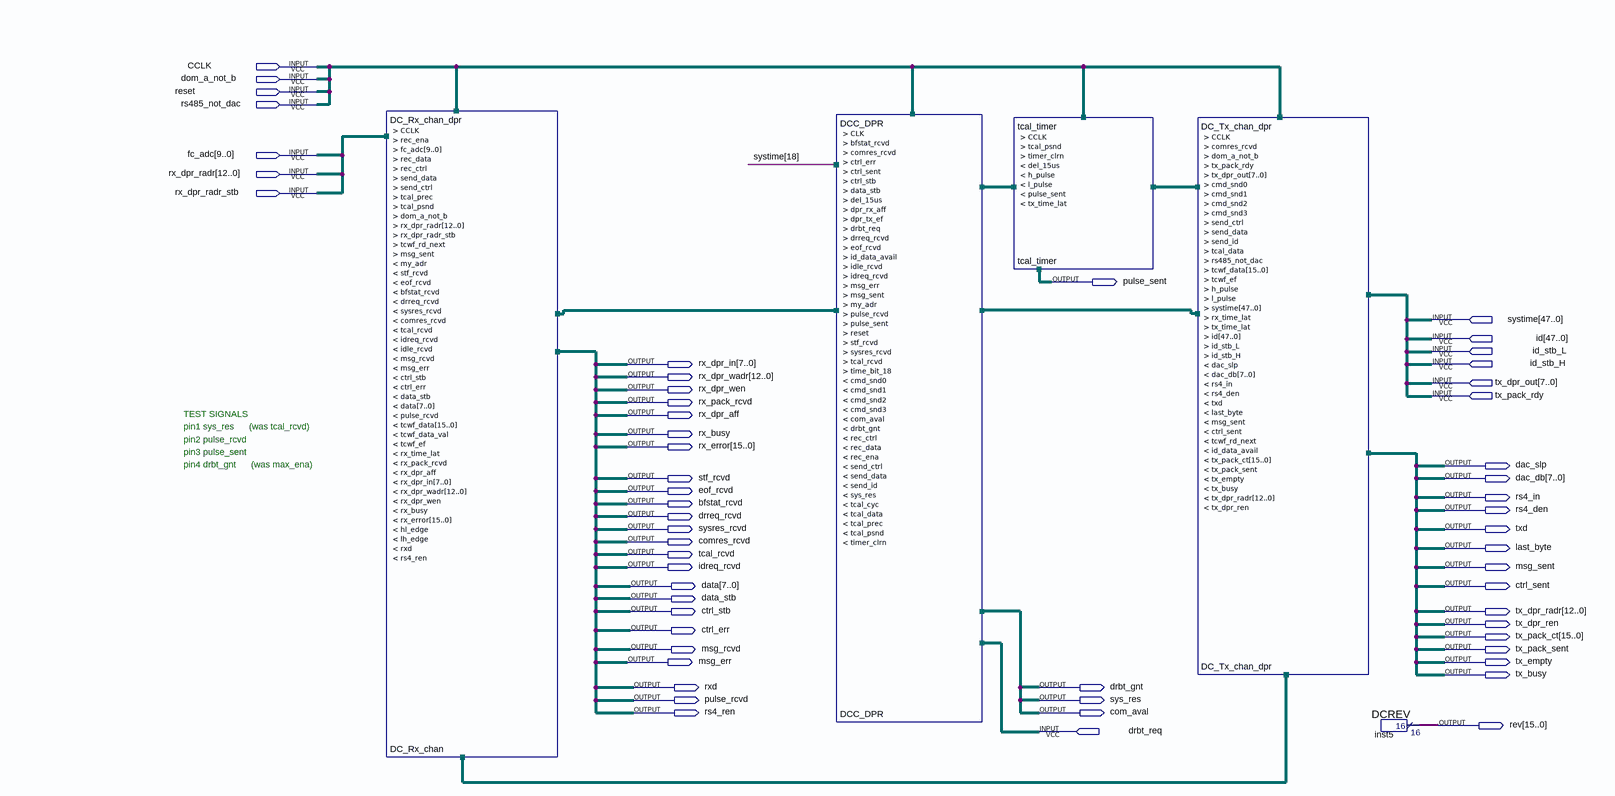
[diagram p0: schematic sheet]
// Quartus schematic dcom_dpr_bak.bdf as structural Verilog: 5 symbols, 57 pins
module dcom_dpr_bak (
  input  CCLK,
  input  dom_a_not_b,
  input  reset,
  input  rs485_not_dac,
  input  [9:0] fc_adc,
  input  [12:0] rx_dpr_radr,
  input  rx_dpr_radr_stb,
  input  [47:0] systime,
  input  [47:0] id,
  input  id_stb_L,
  input  id_stb_H,
  input  [7:0] tx_dpr_out,
  input  tx_pack_rdy,
  input  drbt_req,
  output pulse_sent,
  output [7:0] rx_dpr_in,
  output [12:0] rx_dpr_wadr,
  output rx_dpr_wen,
  output rx_pack_rcvd,
  output rx_dpr_aff,
  output rx_busy,
  output [15:0] rx_error,
  output dac_slp,
  output stf_rcvd,
  output [7:0] dac_db,
  output eof_rcvd,
  output rs4_in,
  output bfstat_rcvd,
  output rs4_den,
  output drreq_rcvd,
  output sysres_rcvd,
  output txd,
  output comres_rcvd,
  output last_byte,
  output tcal_rcvd,
  output idreq_rcvd,
  output msg_sent,
  output [7:0] data,
  output ctrl_sent,
  output data_stb,
  output ctrl_stb,
  output [12:0] tx_dpr_radr,
  output tx_dpr_ren,
  output ctrl_err,
  output [15:0] tx_pack_ct,
  output msg_rcvd,
  output tx_pack_sent,
  output msg_err,
  output tx_empty,
  output tx_busy,
  output rxd,
  output drbt_gnt,
  output pulse_rcvd,
  output sys_res,
  output rs4_ren,
  output com_aval,
  output [15:0] rev
);

  wire cmd_snd0, cmd_snd1, cmd_snd2, cmd_snd3, del_15us, h_pulse, id_data_avail, idle_rcvd, l_pulse, my_adr,
       rec_ctrl, rec_data, rec_ena, rx_time_lat, send_ctrl, send_data, send_id, tcal_data, tcal_prec,
       tcal_psnd, tcwf_ef, tcwf_rd_next, timer_clrn, tx_time_lat;
  wire [15:0] tcwf_data;

  DC_Rx_chan_dpr DC_Rx_chan (
    .CCLK(CCLK), .rec_ena(rec_ena), .fc_adc(fc_adc), .rec_data(rec_data), .rec_ctrl(rec_ctrl),
    .send_data(send_data), .send_ctrl(send_ctrl), .tcal_prec(tcal_prec), .tcal_psnd(tcal_psnd),
    .dom_a_not_b(dom_a_not_b), .rx_dpr_radr(rx_dpr_radr), .rx_dpr_radr_stb(rx_dpr_radr_stb),
    .tcwf_rd_next(tcwf_rd_next), .msg_sent(msg_sent), .my_adr(my_adr), .stf_rcvd(stf_rcvd),
    .eof_rcvd(eof_rcvd), .bfstat_rcvd(bfstat_rcvd), .drreq_rcvd(drreq_rcvd), .sysres_rcvd(sysres_rcvd),
    .comres_rcvd(comres_rcvd), .tcal_rcvd(tcal_rcvd), .idreq_rcvd(idreq_rcvd), .idle_rcvd(idle_rcvd),
    .msg_rcvd(msg_rcvd), .msg_err(msg_err), .ctrl_stb(ctrl_stb), .ctrl_err(ctrl_err), .data_stb(data_stb),
    .data(data), .pulse_rcvd(pulse_rcvd), .tcwf_data(tcwf_data), .tcwf_ef(tcwf_ef),
    .rx_time_lat(rx_time_lat), .rx_pack_rcvd(rx_pack_rcvd), .rx_dpr_aff(rx_dpr_aff), .rx_dpr_in(rx_dpr_in),
    .rx_dpr_wadr(rx_dpr_wadr), .rx_dpr_wen(rx_dpr_wen), .rx_busy(rx_busy), .rx_error(rx_error), .rxd(rxd),
    .rs4_ren(rs4_ren));  // open: tcwf_data_val, hl_edge, lh_edge
  DCC_DPR DCC_DPR (
    .CLK(CCLK), .del_15us(del_15us), .dpr_rx_aff(rx_dpr_aff), .dpr_tx_ef(tx_empty), .drbt_req(drbt_req),
    .pulse_sent(pulse_sent), .time_bit_18(systime[18]), .com_aval(com_aval), .drbt_gnt(drbt_gnt),
    .sys_res(sys_res), .tcal_psnd(tcal_psnd), .timer_clrn(timer_clrn));  // open: bfstat_rcvd, comres_rcvd, ctrl_err, ctrl_sent, ctrl_stb, data_stb, drreq_rcvd, eof_rcvd, id_data_avail, idle_rcvd, idreq_rcvd, msg_err, msg_sent, my_adr, pulse_rcvd, reset, stf_rcvd, sysres_rcvd, tcal_rcvd, cmd_snd0, cmd_snd1, cmd_snd2, cmd_snd3, rec_ctrl, rec_data, rec_ena, send_ctrl, send_data, send_id, tcal_cyc, tcal_data, tcal_prec
  tcal_timer tcal_timer (
    .CCLK(CCLK), .tcal_psnd(tcal_psnd), .timer_clrn(timer_clrn), .del_15us(del_15us), .h_pulse(h_pulse),
    .l_pulse(l_pulse), .pulse_sent(pulse_sent), .tx_time_lat(tx_time_lat));
  DC_Tx_chan_dpr DC_Tx_chan_dpr (
    .CCLK(CCLK), .comres_rcvd(comres_rcvd), .dom_a_not_b(dom_a_not_b), .tx_pack_rdy(tx_pack_rdy),
    .tx_dpr_out(tx_dpr_out), .cmd_snd0(cmd_snd0), .cmd_snd1(cmd_snd1), .cmd_snd2(cmd_snd2),
    .cmd_snd3(cmd_snd3), .send_ctrl(send_ctrl), .send_data(send_data), .send_id(send_id),
    .tcal_data(tcal_data), .rs485_not_dac(rs485_not_dac), .tcwf_data(tcwf_data), .tcwf_ef(tcwf_ef),
    .h_pulse(h_pulse), .l_pulse(l_pulse), .systime(systime), .rx_time_lat(rx_time_lat),
    .tx_time_lat(tx_time_lat), .id(id), .id_stb_L(id_stb_L), .id_stb_H(id_stb_H), .dac_slp(dac_slp),
    .dac_db(dac_db), .rs4_in(rs4_in), .rs4_den(rs4_den), .txd(txd), .last_byte(last_byte),
    .msg_sent(msg_sent), .ctrl_sent(ctrl_sent), .tcwf_rd_next(tcwf_rd_next), .id_data_avail(id_data_avail),
    .tx_pack_ct(tx_pack_ct), .tx_pack_sent(tx_pack_sent), .tx_empty(tx_empty), .tx_busy(tx_busy),
    .tx_dpr_radr(tx_dpr_radr), .tx_dpr_ren(tx_dpr_ren));
  DCREV inst5 (.result(rev));

  // Notes on the sheet:
  //   TEST SIGNALS
  //   pin1 sys_res      (was tcal_rcvd)
  //   pin2 pulse_rcvd
  //   pin3 pulse_sent
  //   pin4 drbt_gnt      (was max_ena)
endmodule
